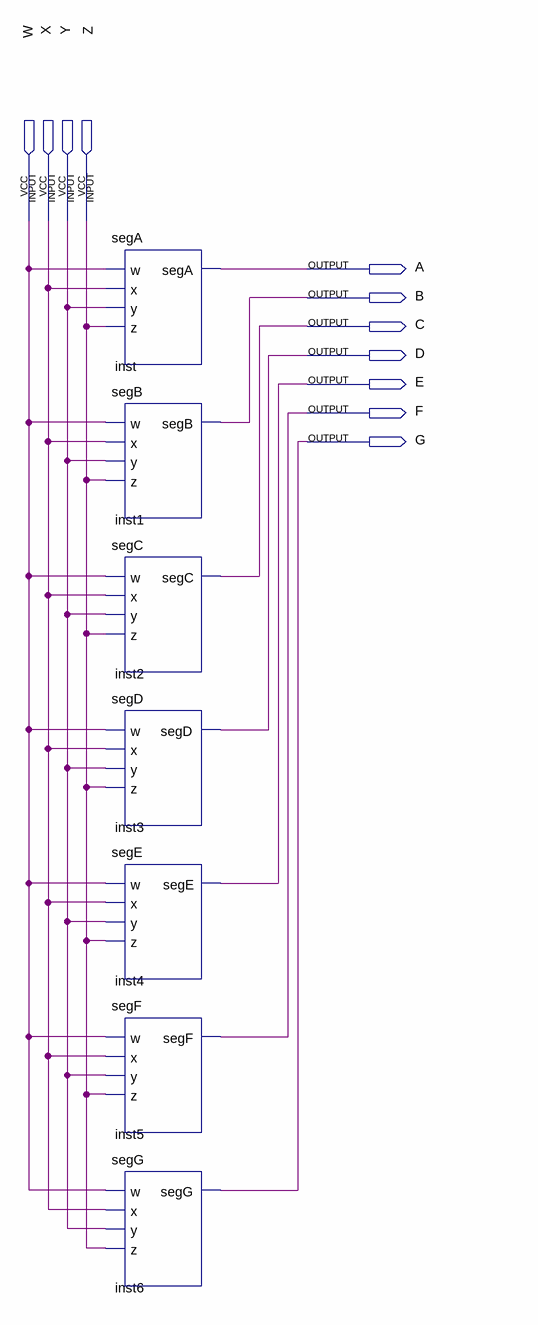
[diagram p0: schematic sheet]
// Quartus schematic HEX2SSD.bdf as structural Verilog: 7 symbols, 11 pins
module HEX2SSD (
  input  W,
  input  X,
  input  Y,
  input  Z,
  output A,
  output B,
  output C,
  output D,
  output E,
  output F,
  output G
);

  segA inst (.w(W), .x(X), .y(Y), .z(Z), .segA(A));
  segB inst1 (.w(W), .x(X), .y(Y), .z(Z), .segB(B));
  segC inst2 (.w(W), .x(X), .y(Y), .z(Z), .segC(C));
  segD inst3 (.w(W), .x(X), .y(Y), .z(Z), .segD(D));
  segE inst4 (.w(W), .x(X), .y(Y), .z(Z), .segE(E));
  segF inst5 (.w(W), .x(X), .y(Y), .z(Z), .segF(F));
  segG inst6 (.w(W), .x(X), .y(Y), .z(Z), .segG(G));
endmodule
